# Altium schematic sheet Sheet3.SchDoc: Наименование
size 420 x 297 mm; ApprovedBy: Vasil; CheckedBy: Vasil; Author: Vasil; CompanyName: Vasil; DrawnBy: n.a.; Engineer: Vasil; SheetNumber: 3; SheetTotal: 5; PageSetup: Record=PageOptions|CenterHorizontal=True|CenterVertical=True|PrintScale=0.94|XCorrection=1.00|YCorrection=1.00|PrintKind=1|BorderSize=5000000|LeftOffset=0|BottomOffset=0|Orientation=1|PaperLength=1000|PaperWidth=1000|Scale=100|PaperSource=7|PrintQuality=-4|MediaType=1|DitherType=10|PaperKind=A4|PrintScaleMode=1; DecimalNumber: 000.00006.001.VG; HeadOfSector: n.a.; MainDevice: HW; Name: CNC_interfaces_board; DocumentName: Sheet1.SCHDOC
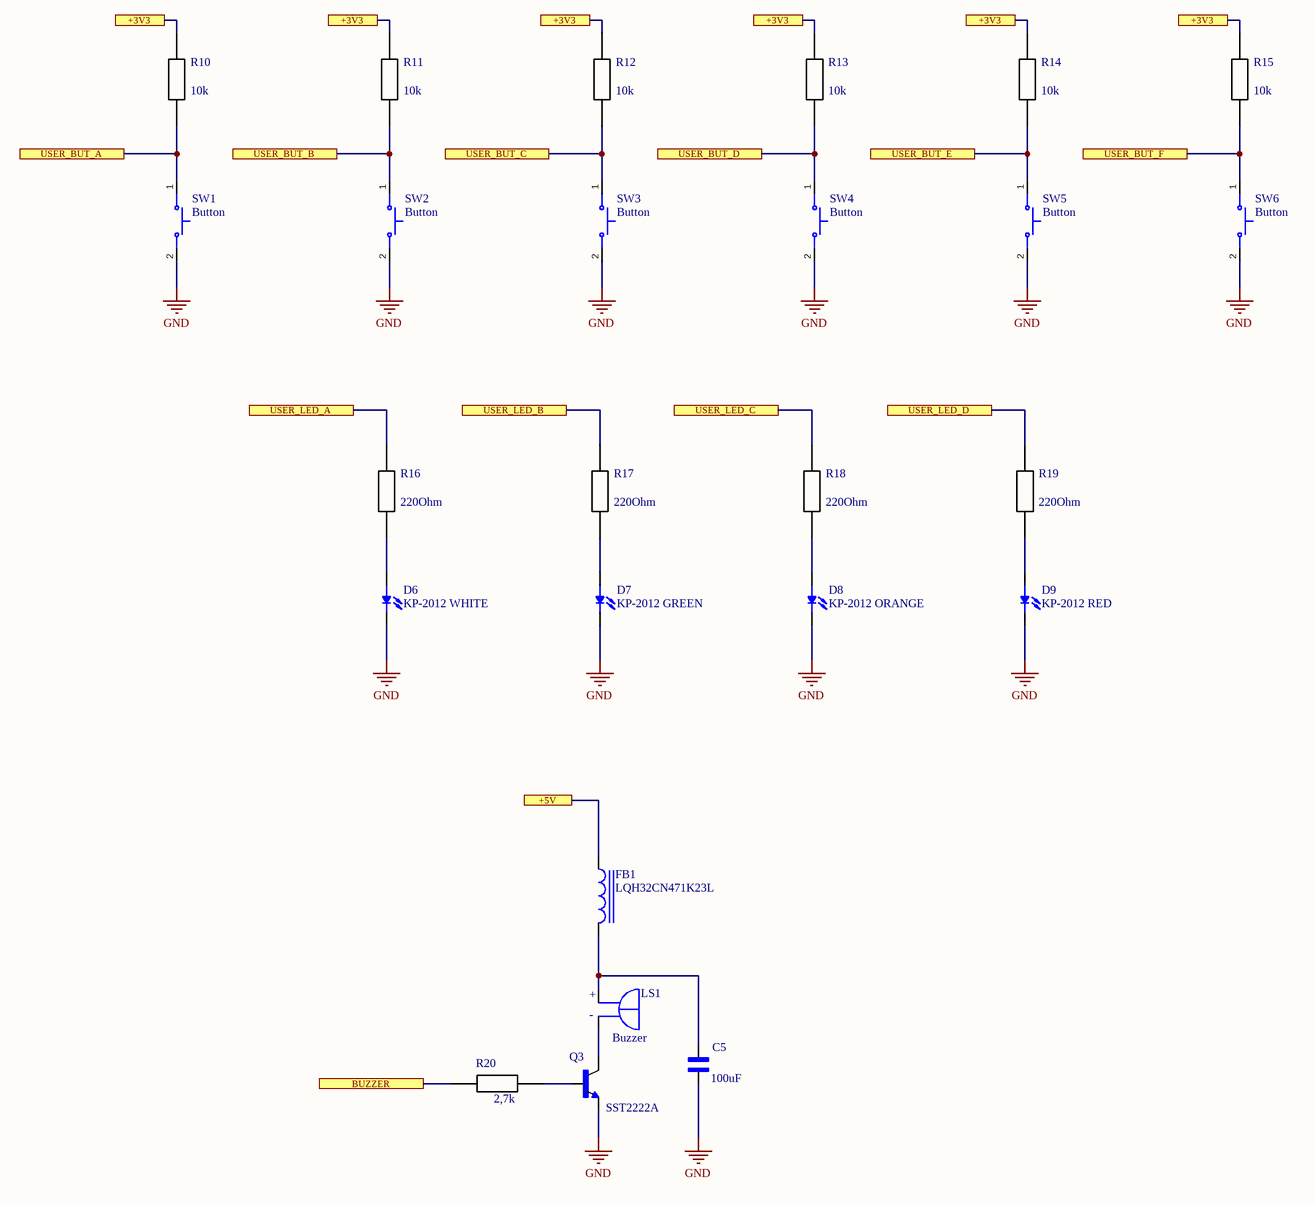
[diagram p0: Sheet3.SchDoc]

## Parts
C5  100uF  [*CAPC3326X230N]
D6  KP-2012 WHITE  [SMD 0805 LED-Y]
D7  KP-2012 GREEN  [SMD 0805 LED-Y]
D8  KP-2012 ORANGE  [SMD 0805 LED-Y]
D9  KP-2012 RED  [SMD 0805 LED-Y]
FB1  LQH32CN471K23L  [SMD 1210 LQH]
LS1  Buzzer  [XDCR_KSSG13J12-N]
Q3  SST2222A  [SOT-23-3]
R10  10k  [SMD 0805]
R11  10k  [SMD 0805]
R12  10k  [SMD 0805]
R13  10k  [SMD 0805]
R14  10k  [SMD 0805]
R15  10k  [SMD 0805]
R16  220Ohm  [SMD 0805]
R17  220Ohm  [SMD 0805]
R18  220Ohm  [SMD 0805]
R19  220Ohm  [SMD 0805]
R20  2,7k  [SMD 0805]
SW1  Button  [SW_KSR221GLFS]
SW2  Button  [SW_KSR221GLFS]
SW3  Button  [SW_KSR221GLFS]
SW4  Button  [SW_KSR221GLFS]
SW5  Button  [SW_KSR221GLFS]
SW6  Button  [SW_KSR221GLFS]

## Ports
+3V3, +5V, BUZZER, USER_BUT_A, USER_BUT_B, USER_BUT_C, USER_BUT_D, USER_BUT_E, USER_BUT_F, USER_LED_A, USER_LED_B, USER_LED_C, USER_LED_D

## Nets
GND: C5.1 D6.C D7.C D8.C D9.C Q3.2(E) SW1.2 SW2.2 SW3.2 SW4.2 SW5.2 SW6.2
+3V3: R10.1 R11.1 R12.1 R13.1 R14.1 R15.1 ; port +3V3
+5V: FB1.1 ; port +5V
BUZZER: R20.1 ; port BUZZER
USER_BUT_A: R10.2 SW1.1 ; port USER_BUT_A
USER_BUT_B: R11.2 SW2.1 ; port USER_BUT_B
USER_BUT_C: R12.2 SW3.1 ; port USER_BUT_C
USER_BUT_D: R13.2 SW4.1 ; port USER_BUT_D
USER_BUT_E: R14.2 SW5.1 ; port USER_BUT_E
USER_BUT_F: R15.2 SW6.1 ; port USER_BUT_F
USER_LED_A: R16.1 ; port USER_LED_A
USER_LED_B: R17.1 ; port USER_LED_B
USER_LED_C: R18.1 ; port USER_LED_C
USER_LED_D: R19.1 ; port USER_LED_D
NetC5_2: C5.2 FB1.2 LS1.P(POS)
NetD6_A: D6.A R16.2
NetD7_A: D7.A R17.2
NetD8_A: D8.A R18.2
NetD9_A: D9.A R19.2
NetLS1_N: LS1.N(NEG) Q3.3(C)
NetQ3_1: Q3.1(B) R20.2

## Notes on the sheet
- Перв.примен.
- Справ.№
- Подп. и дата
- Инв.№ дубл.
- Взам.инв.№
- Подп.и дата
- Разраб.
- Изм.
- Лист
- № докум.
- Подп.
- Дата
- Лит.
- Масштаб
- Масса
- Т.контр.
- Пров.
- СХЕМА   ЭЛЕКТРИЧЕСКАЯ
- ПРИНЦИПИАЛЬНАЯ
- Листов
- Инв.№ подл.
- Утв.
- Н.контр.
- Нач.сект.
- Формат  A3
- (in symbol KSSG13J12-N) +; -

## Library data of the parts
C5 = CL32B106KLJNNNE: C1210 10uF 35V X7R; Manufacturer: SAMSUNG ELECTRO-MECHANICS; HelpURL: https://store.comet.bg/Catalogue/Product/36844/; Model: CL32B106KLJNNNE; Case: SMD 1210; Value: 100uF
D6-D9 = KP-2012: LED 2.0x1.25mm, 50-160 mcd@20mA, W.Clear, 120°; MP: SMLMN2WB1CW1C; MF: Rohm Semiconductor; SnapEDA_Link: https://www.snapeda.com/parts/SMLMN2WB1CW1C/Rohm/view-part/3217279/?ref=snap; Availability: Unavailable; Value: KP-2012; Price: None; Package: 0805 Rohm Semiconductor
FB1 = LQH32CN471K23L: 470uH 19Ohm 60mA 10%    47uH 1.3Ohm 170mA 10%; MF: MURATA ELECTRONICS; Package: 1210; MP: LQH32CN471K; URL 47uH: https://store.comet.bg/Catalogue/Product/48001/; URL 470uH: https://store.comet.bg/Catalogue/Product/48004/; Value: LQH32CN471K23L
LS1 = KSSG13J12-N: Availability: Unavailable; Price: None; Package: None; Value: Buzzer; MP: KSSG13J12-N
Q3 = SST2222A: Transistor NPN 40V 600mA 300MHz 350mW; Manufacturer: ROHM Semiconductor; Case: SOT-23-3 SST3; HelpURL: https://store.comet.bg/Catalogue/Product/23715/; Value: SST2222A
R10-R20 = Resistor_1: RES; HelpURL: https://store.comet.bg/Catalogue/RES/Resistors/#eyJpcHAiOiIxMDAiLCJtIjoiIn0%3D
  R10-R15: Value: 10k
  R16-R19: Value: 220Ohm
  R20: Value: 2,7k
SW1-SW6 = KSR221GLFS: Tactile Switch 2p SPST-NO 50mA/32V 6x3.8x2.5mm; MF: C&K; MP: KSR221GLFS; Package: 6x3.8x2.5mm; URL: https://store.comet.bg/Catalogue/Product/17512/; Value: Button